# EAGLE design vdac (EAGLE 8.3.1)

## Sheet 1 of 4
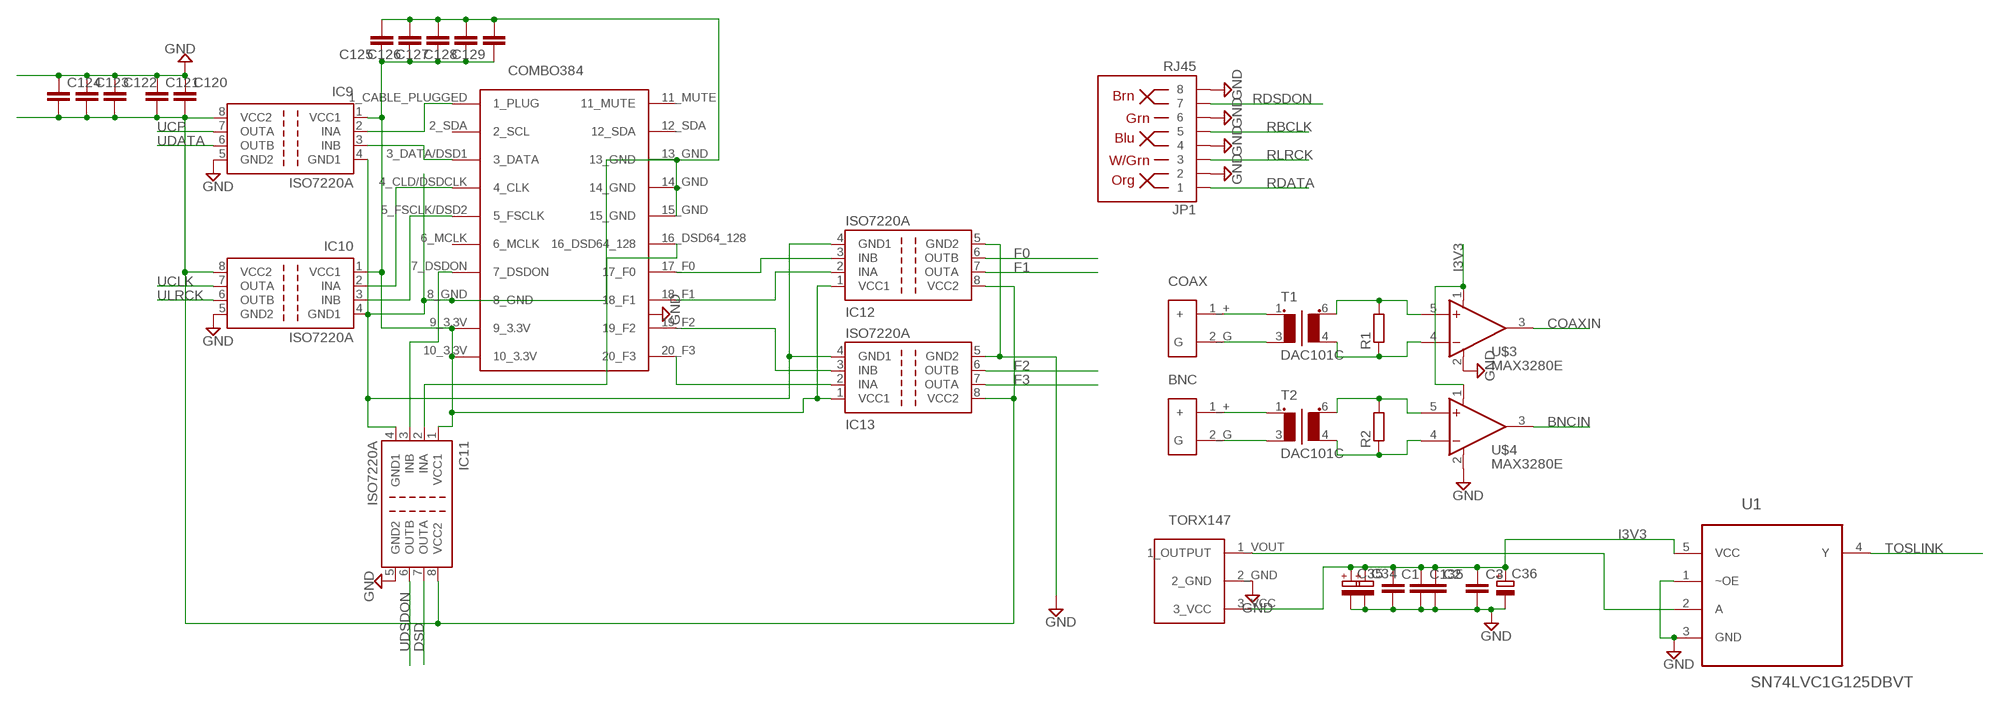
[diagram p0: schematic, sheet 1]

### Parts
BNC  RCA  [RCA]
C1  C-EUC0805  [C0805]
C2  C-EUC0805  [C0805]
C3  C-EUC0805  [C0805]
C34  CPOL-EUSP-CAP-CX  [SP-CAP-CX]
C35  CPOL-EUSP-CAP-CX  [SP-CAP-CX]
C36  CPOL-EUSP-CAP-CX  [SP-CAP-CX]
C120  C-EUC0805  [C0805]
C121  C-EUC0805  [C0805]
C122  C-EUC0805  [C0805]
C123  C-EUC0805  [C0805]
C124  C-EUC0805  [C0805]
C125  C-EUC0805  [C0805]
C126  C-EUC0805  [C0805]
C127  C-EUC0805  [C0805]
C128  C-EUC0805  [C0805]
C129  C-EUC0805  [C0805]
C135  C-EUC0805  [C0805]
COAX  RCA  [RCA]
IC9  ISO7220A  [SO-08]
IC10  ISO7220A  [SO-08]
IC11  ISO7220A  [SO-08]
IC12  ISO7220A  [SO-08]
IC13  ISO7220A  [SO-08]
JP1  RJ45  RJ45-8PTH  [RJ45-8]
R1  R-EU_MELF0204W  [MINI_MELF-0204W]
R2  R-EU_MELF0204W  [MINI_MELF-0204W]
T1  DAC101C  [DAC101]
T2  DAC101C  [DAC101]
U1  SN74LVC1G125DBVT  [SOT95P280X145-5N]
U$1  COMBO384  [COMBO384]
U$2  TORX147  [TORX147]
U$3  MAX3280E  [SOT23-5L]
U$4  MAX3280E  [SOT23-5L]

### Nets
BNCIN: U$4.3(OUT) ; also sheet 3
COAXIN: U$3.3(OUT) ; also sheet 3
DSD: IC11.7(OUTA) ; also sheet 3
F0: IC12.6(OUTB) ; also sheet 3
F1: IC12.7(OUTA) ; also sheet 3
F2: IC13.6(OUTB) ; also sheet 3
F3: IC13.7(OUTA) ; also sheet 3
GND: C1.2 C2.2 C3.2 C34.- C35.- C36.- C120.1 C121.1 C122.1 C123.1 C124.1 C135.2 IC9.5(GND2) IC10.5(GND2) IC11.5(GND2) IC12.5(GND2) IC13.5(GND2) JP1.2 JP1.4 JP1.6 JP1.8 U1.1(~OE) U1.3(GND) U$2.2_GND U$3.2(V-) U$4.2(V-) ; also sheet 2,3,4
I3V3: C1.1 C2.1 C3.1 C34.+ C35.+ C36.+ C120.2 C121.2 C122.2 C123.2 C124.2 C135.1 IC9.8(VCC2) IC10.8(VCC2) IC11.8(VCC2) IC12.8(VCC2) IC13.8(VCC2) U1.5(VCC) U$2.3_VCC U$3.1(V+) U$4.1(V+) ; also sheet 3
N$1: COAX.1_+(+) T1.1
N$2: COAX.2_G(G) T1.3(P2)
N$3: BNC.1_+(+) T2.1
N$4: BNC.2_G(G) T2.3(P2)
N$5: R1.2 T1.6(S1) U$3.5(+IN)
N$6: R1.1 T1.4(S2) U$3.4(-IN)
N$7: R2.2 T2.6(S1) U$4.5(+IN)
N$8: R2.1 T2.4(S2) U$4.4(-IN)
N$86: U1.2(A) U$2.1_VOUT(1_OUTPUT)
N$90: IC9.2(INA) U$1.1_CABLE_PLUGGED(1_PLUG)
N$93: IC9.3(INB) U$1.3_DATA/DSD1(3_DATA)
N$94: IC10.2(INA) U$1.4_CLD/DSDCLK(4_CLK)
N$95: IC10.3(INB) U$1.5_FSCLK/DSD2(5_FSCLK)
N$97: IC11.3(INB) U$1.7_DSDON
N$98: C125.1 C126.1 C127.1 C128.1 C129.1 IC9.1(VCC1) IC10.1(VCC1) IC11.1(VCC1) IC12.1(VCC1) IC13.1(VCC1) U$1.9_3.3V U$1.10_3.3V
N$99: IC11.2(INA) U$1.16_DSD64_128
N$100: IC12.3(INB) U$1.17_F0
N$101: IC12.2(INA) U$1.18_F1
N$102: IC13.3(INB) U$1.19_F2
N$103: IC13.2(INA) U$1.20_F3
RBCLK: JP1.5 ; also sheet 3
RDATA: JP1.1 ; also sheet 3
RDSDON: JP1.7 ; also sheet 3
RLRCK: JP1.3 ; also sheet 3
TOSLINK: U1.4(Y) ; also sheet 3
UCLK: IC10.7(OUTA) ; also sheet 3
UCP: IC9.7(OUTA)
UDATA: IC9.6(OUTB) ; also sheet 3
UDSDON: IC11.6(OUTB) ; also sheet 3
UGND: C125.2 C126.2 C127.2 C128.2 C129.2 IC9.4(GND1) IC10.4(GND1) IC11.4(GND1) IC12.4(GND1) IC13.4(GND1) U$1.8_GND U$1.13_GND U$1.14_GND U$1.15_GND
ULRCK: IC10.6(OUTB) ; also sheet 3
Unconnected: U$1.2_SDA(2_SCL) U$1.6_MCLK U$1.11_MUTE U$1.12_SDA

## Sheet 2 of 4
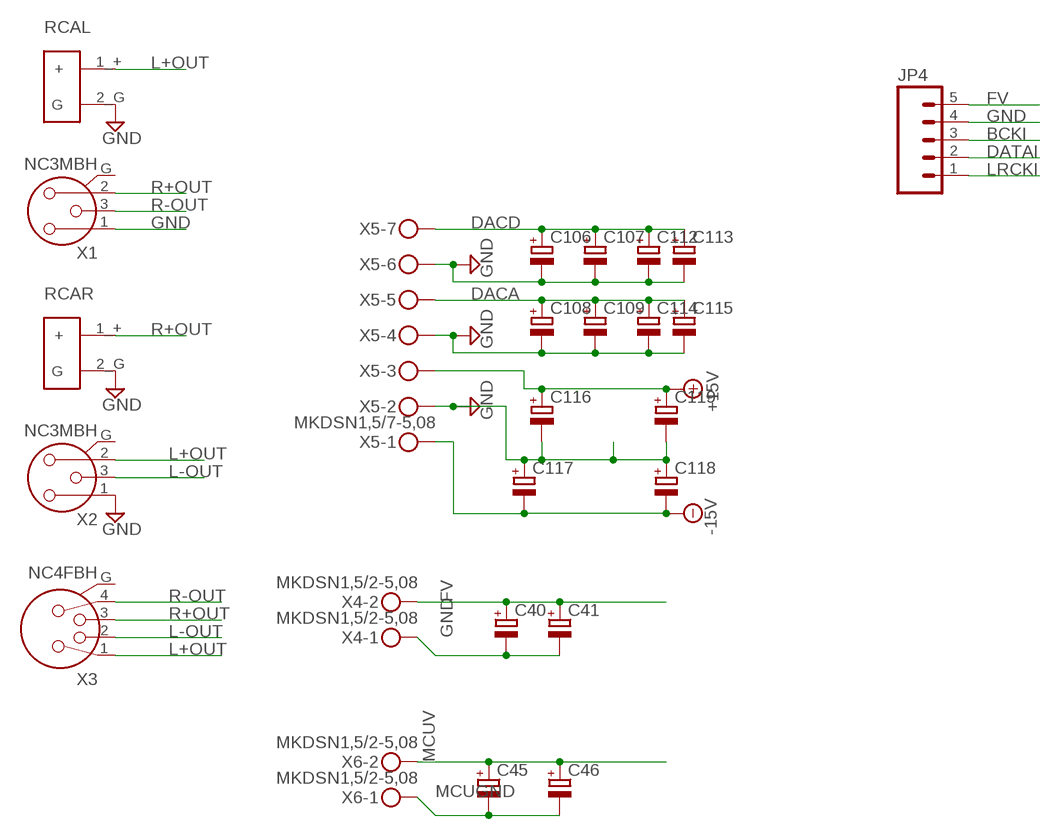
[diagram p1: schematic, sheet 2]

### Parts
C40  CPOL-EUSP-CAP-CX  [SP-CAP-CX]
C41  CPOL-EUSP-CAP-CX  [SP-CAP-CX]
C45  CPOL-EUSP-CAP-CX  [SP-CAP-CX]
C46  CPOL-EUSP-CAP-CX  [SP-CAP-CX]
C106  CPOL-EUSP-CAP-CX  [SP-CAP-CX]
C107  CPOL-EUSP-CAP-CX  [SP-CAP-CX]
C108  CPOL-EUSP-CAP-CX  [SP-CAP-CX]
C109  CPOL-EUSP-CAP-CX  [SP-CAP-CX]
C112  CPOL-EUSP-CAP-CX  [SP-CAP-CX]
C113  CPOL-EUSP-CAP-CX  [SP-CAP-CX]
C114  CPOL-EUSP-CAP-CX  [SP-CAP-CX]
C115  CPOL-EUSP-CAP-CX  [SP-CAP-CX]
C116  CPOL-EUSP-CAP-CX  [SP-CAP-CX]
C117  CPOL-EUSP-CAP-CX  [SP-CAP-CX]
C118  CPOL-EUSP-CAP-CX  [SP-CAP-CX]
C119  CPOL-EUSP-CAP-CX  [SP-CAP-CX]
JP4  M05PTH_LONGPADS  [1X05_LONGPADS]
RCAL  RCA  [RCA]
RCAR  RCA  [RCA]
X1  NC3MBH  [NC3MBH]
X2  NC3MBH  [NC3MBH]
X3  NC4FBH  [NC4FBH]
X4  MKDSN1,5/2-5,08  [MKDSN1,5/2-5,08]
X5  MKDSN1,5/7-5,08  [MKDSN1,5/7-5,08]
X6  MKDSN1,5/2-5,08  [MKDSN1,5/2-5,08]

### Nets
+15V: C116.+ C119.+ X5.3 ; also sheet 4
-15V: C117.- C118.- X5.1 ; also sheet 4
BCKI: JP4.3 ; also sheet 3
DACA: C108.+ C109.+ C114.+ C115.+ X5.5
DACD: C106.+ C107.+ C112.+ C113.+ X5.7
DATAI: JP4.2 ; also sheet 3
FV: C40.+ C41.+ JP4.5 X4.2 ; also sheet 3
GND: C40.- C41.- C106.- C107.- C108.- C109.- C112.- C113.- C114.- C115.- C116.- C117.+ C118.+ C119.- JP4.4 RCAL.2_G(G) RCAR.2_G(G) X1.1 X2.1 X4.1 X5.2 X5.4 X5.6 ; also sheet 1,3,4
L+OUT: RCAL.1_+(+) X2.2 X3.1
L-OUT: X2.3 X3.2
LRCKI: JP4.1 ; also sheet 3
MCUGND: C45.- C46.- X6.1 ; also sheet 3
MCUV: C45.+ C46.+ X6.2 ; also sheet 3
R+OUT: RCAR.1_+(+) X1.2 X3.3
R-OUT: X1.3 X3.4
Unconnected: X1.G X2.G X3.G

## Sheet 3 of 4
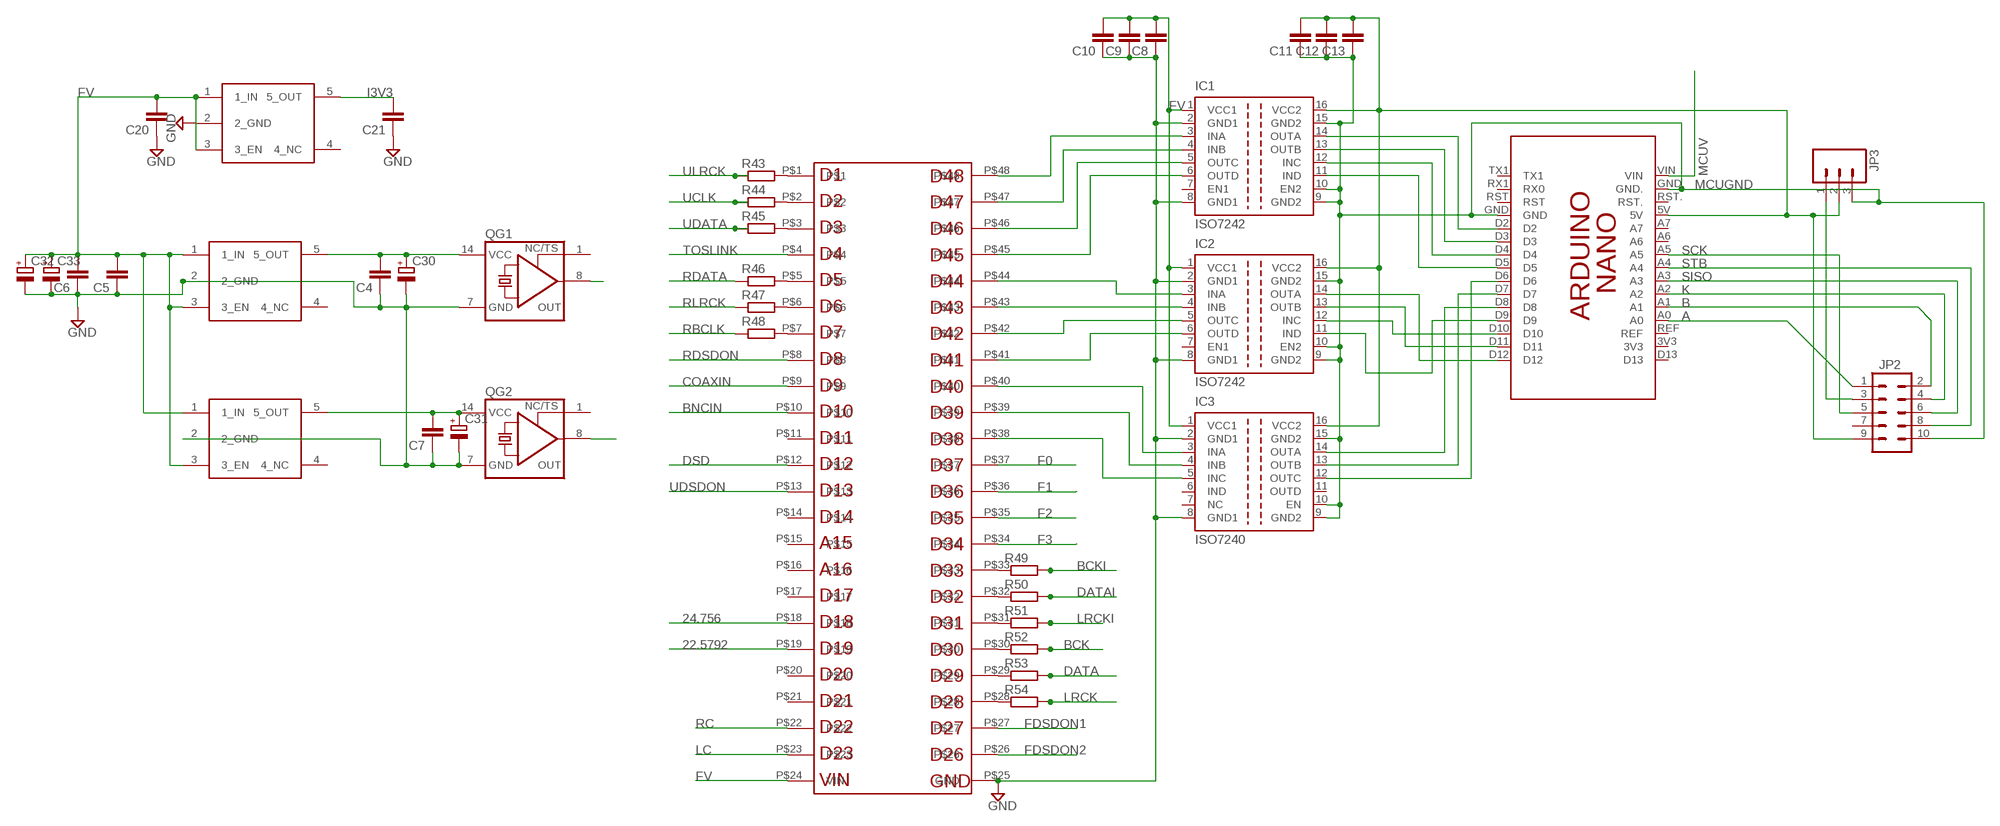
[diagram p2: schematic, sheet 3]

### Parts
C4  C-EUC0805  [C0805]
C5  C-EUC0805  [C0805]
C6  C-EUC0805  [C0805]
C7  C-EUC0805  [C0805]
C8  C-EUC0805  [C0805]
C9  C-EUC0805  [C0805]
C10  C-EUC0805  [C0805]
C11  C-EUC0805  [C0805]
C12  C-EUC0805  [C0805]
C13  C-EUC0805  [C0805]
C20  C-EUC0805  [C0805]
C21  C-EUC0805  [C0805]
C30  CPOL-EUSP-CAP-CX  [SP-CAP-CX]
C31  CPOL-EUSP-CAP-CX  [SP-CAP-CX]
C32  CPOL-EUSP-CAP-CX  [SP-CAP-CX]
C33  CPOL-EUSP-CAP-CX  [SP-CAP-CX]
IC1  ISO7242  [SO-16DW]
IC2  ISO7242  [SO-16DW]
IC3  ISO7240  [SO-16DW]
JP2  M05X2SHD  [2X5-SHROUDED]
JP3  M03JST-PTH-VERT  [JST-3-PTH-VERT]
PCB1  ARDUINO_NANO  [ARDUINO_NANO]
QG1  XO-14  [DIL14S]
QG2  XO-14  [DIL14S]
R43  R-EU_MELF0204W  [MINI_MELF-0204W]
R44  R-EU_MELF0204W  [MINI_MELF-0204W]
R45  R-EU_MELF0204W  [MINI_MELF-0204W]
R46  R-EU_MELF0204W  [MINI_MELF-0204W]
R47  R-EU_MELF0204W  [MINI_MELF-0204W]
R48  R-EU_MELF0204W  [MINI_MELF-0204W]
R49  R-EU_MELF0204W  [MINI_MELF-0204W]
R50  R-EU_MELF0204W  [MINI_MELF-0204W]
R51  R-EU_MELF0204W  [MINI_MELF-0204W]
R52  R-EU_MELF0204W  [MINI_MELF-0204W]
R53  R-EU_MELF0204W  [MINI_MELF-0204W]
R54  R-EU_MELF0204W  [MINI_MELF-0204W]
U$10  LP5907  [SOT-23-5]
U$12  CMOD-A7  [CMODA7]
U$15  LP5907  [SOT-23-5]
U$16  LP5907  [SOT-23-5]

### Nets
22.5792: QG2.8(OUT) U$12.P$19
24.756: QG1.8(OUT) U$12.P$18
A: JP2.1 PCB1.A0
B: JP2.2 PCB1.A1
BCK: R52.2
BCKI: R49.2 ; also sheet 2
BNCIN: U$12.P$10 ; also sheet 1
COAXIN: U$12.P$9 ; also sheet 1
D2: IC1.14(OUTA) PCB1.D2
D3: IC1.13(OUTB) PCB1.D3
D4: IC1.12(INC) PCB1.D4
D5: IC1.11(IND) PCB1.D5
DATA: R53.2
DATAI: R50.2 ; also sheet 2
DSD: U$12.P$12 ; also sheet 1
F0: U$12.P$37 ; also sheet 1
F1: U$12.P$36 ; also sheet 1
F2: U$12.P$35 ; also sheet 1
F3: U$12.P$34 ; also sheet 1
FDSDON1: U$12.P$27
FDSDON2: U$12.P$26
FV: C5.2 C6.2 C8.2 C9.2 C10.2 C20.2 C32.+ C33.+ IC1.1(VCC1) IC2.1(VCC1) IC3.1(VCC1) U$10.1(1_IN) U$10.3(3_EN) U$12.P$24(VIN) U$15.1(1_IN) U$15.3(3_EN) U$16.1(1_IN) U$16.3(3_EN) ; also sheet 2
GND: C4.1 C5.1 C6.1 C7.1 C8.1 C9.1 C10.1 C20.1 C21.1 C30.- C31.- C32.- C33.- IC1.2(GND1) IC1.8(GND1) IC2.2(GND1) IC2.8(GND1) IC3.2(GND1) IC3.8(GND1) QG1.7(GND) QG2.7(GND) U$10.2(2_GND) U$12.P$25(GND) U$15.2(2_GND) U$16.2(2_GND) ; also sheet 1,2,4
I3V3: C21.2 U$10.5(5_OUT) ; also sheet 1
K: JP2.4 PCB1.A2
LC: U$12.P$23
LRCK: R54.2
LRCKI: R51.2 ; also sheet 2
MCUGND: C11.1 C12.1 C13.1 IC1.9(GND2) IC1.10(EN2) IC1.15(GND2) IC2.9(GND2) IC2.10(EN2) IC2.15(GND2) IC3.9(GND2) IC3.10(EN) IC3.15(GND2) JP2.10 JP3.3 PCB1.GND PCB1.GND. ; also sheet 2
MCUV: PCB1.VIN ; also sheet 2
N$20: R43.2 U$12.P$1
N$25: C4.2 C30.+ QG1.14(VCC) U$15.5(5_OUT)
N$27: C7.2 C31.+ QG2.14(VCC) U$16.5(5_OUT)
N$32: IC1.3(INA) U$12.P$48
N$33: IC1.4(INB) U$12.P$47
N$35: IC1.5(OUTC) U$12.P$46
N$36: IC1.6(OUTD) U$12.P$45
N$39: IC2.3(INA) U$12.P$44
N$40: IC2.4(INB) U$12.P$43
N$42: IC2.5(OUTC) U$12.P$42
N$43: IC2.6(OUTD) U$12.P$41
N$44: IC3.3(INA) U$12.P$40
N$45: IC3.4(INB) U$12.P$39
N$46: IC3.5(INC) U$12.P$38
N$51: IC2.14(OUTA) PCB1.D12
N$52: IC2.13(OUTB) PCB1.D11
N$53: IC2.12(INC) PCB1.D10
N$54: IC2.11(IND) PCB1.D9
N$55: IC3.14(OUTA) PCB1.D8
N$56: IC3.13(OUTB) PCB1.D7
N$57: IC3.12(OUTC) PCB1.D6
N$91: C11.2 C12.2 C13.2 IC1.16(VCC2) IC2.16(VCC2) IC3.16(VCC2) JP2.9 JP3.2 PCB1.5V
N$92: JP2.3 JP3.1
N$129: R44.2 U$12.P$2
N$132: R45.2 U$12.P$3
N$133: R46.2 U$12.P$5
N$134: R47.2 U$12.P$6
N$135: R48.2 U$12.P$7
N$136: R49.1 U$12.P$33
N$137: R50.1 U$12.P$32
N$138: R51.1 U$12.P$31
N$139: R52.1 U$12.P$30
N$140: R53.1 U$12.P$29
N$141: R54.1 U$12.P$28
RBCLK: R48.1 ; also sheet 1
RC: U$12.P$22
RDATA: R46.1 ; also sheet 1
RDSDON: U$12.P$8 ; also sheet 1
RLRCK: R47.1 ; also sheet 1
SCK: JP2.5 PCB1.A5
SISO: JP2.6 PCB1.A3
STB: JP2.8 PCB1.A4
TOSLINK: U$12.P$4 ; also sheet 1
UCLK: R44.1 ; also sheet 1
UDATA: R45.1 ; also sheet 1
UDSDON: U$12.P$13 ; also sheet 1
ULRCK: R43.1 ; also sheet 1
Unconnected: IC1.7(EN1) IC2.7(EN1) IC3.6(IND) IC3.7(NC) IC3.11(OUTD) JP2.7 PCB1.3V3 PCB1.A6 PCB1.A7 PCB1.D13 PCB1.REF PCB1.RST PCB1.RST. PCB1.RX1(RX0) PCB1.TX1 QG1.1(TS) QG2.1(TS) U$10.4(4_NC) U$12.P$11 U$12.P$14 U$12.P$15 U$12.P$16 U$12.P$17 U$12.P$20 U$12.P$21 U$15.4(4_NC) U$16.4(4_NC)

## Sheet 4 of 4
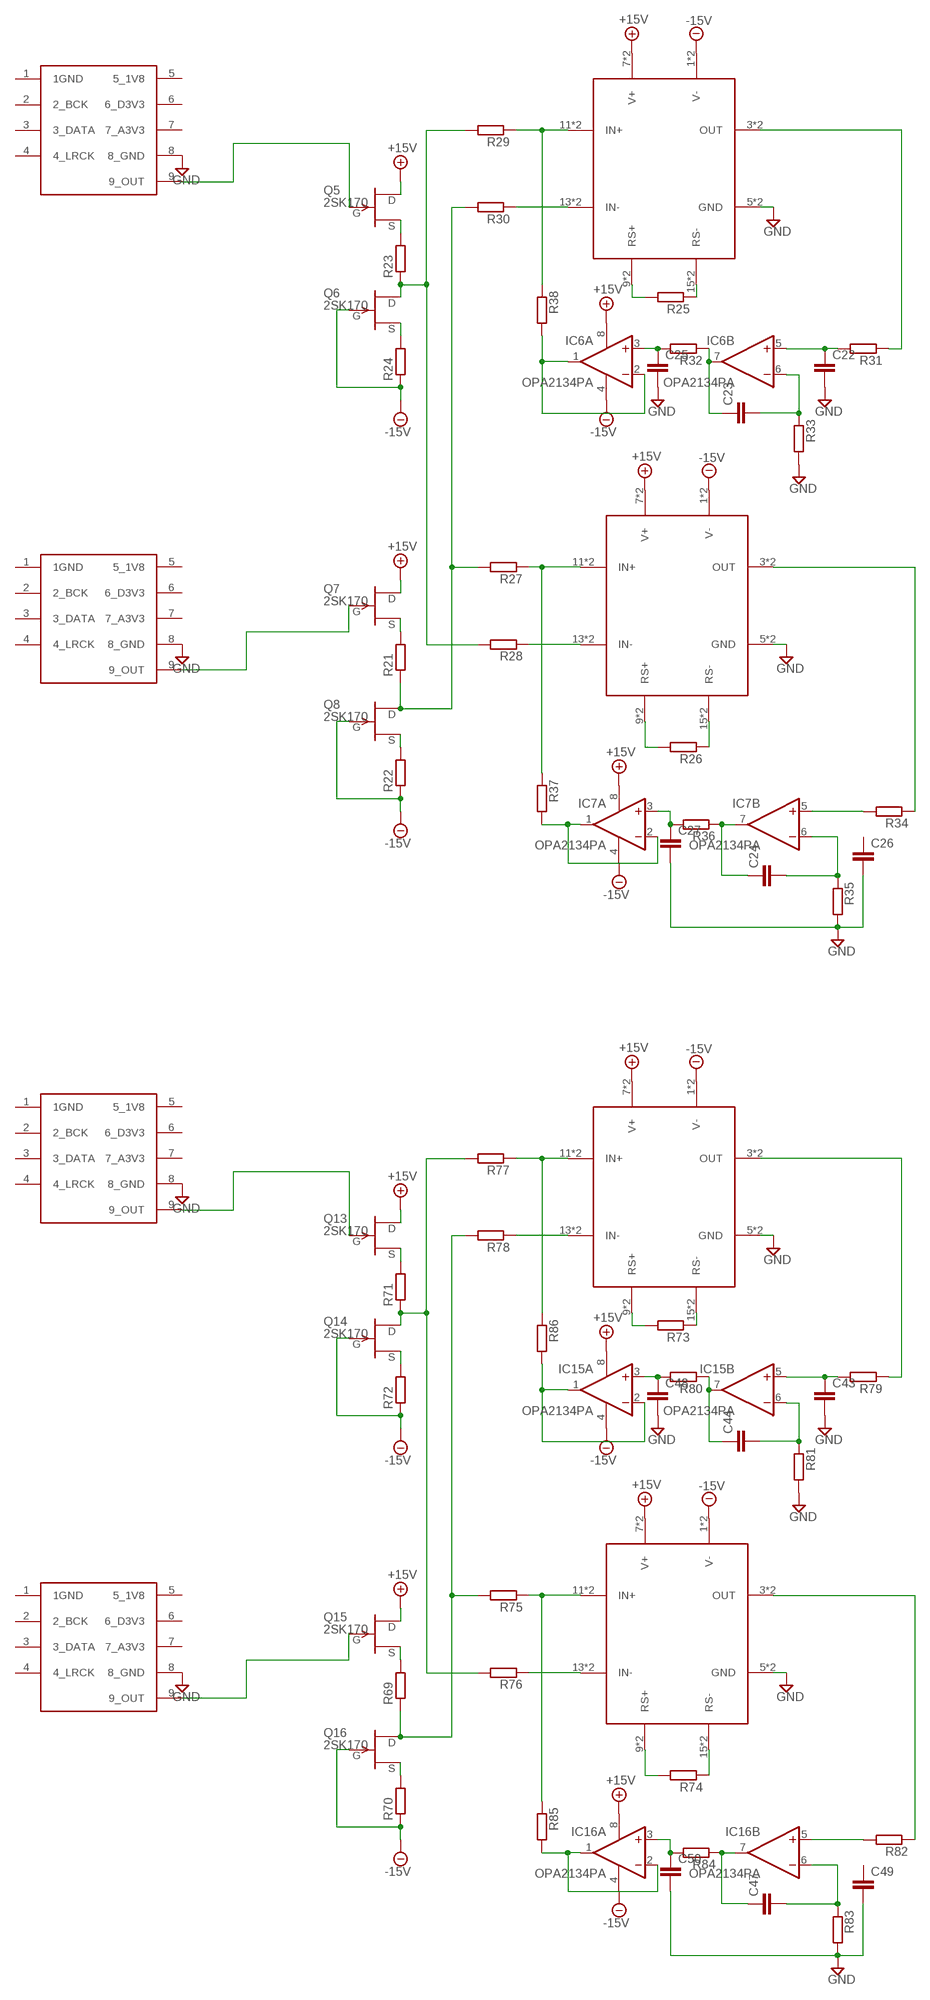
[diagram p3: schematic, sheet 4]

### Parts
C22  C-EU050-050X075  [C050-050X075]
C23  C-EU050-035X075  [C050-035X075]
C24  C-EU050-035X075  [C050-035X075]
C25  C-EU050-035X075  [C050-035X075]
C26  C-EU050-050X075  [C050-050X075]
C27  C-EU050-035X075  [C050-035X075]
C43  C-EU050-050X075  [C050-050X075]
C44  C-EU050-035X075  [C050-035X075]
C47  C-EU050-035X075  [C050-035X075]
C48  C-EU050-035X075  [C050-035X075]
C49  C-EU050-050X075  [C050-050X075]
C50  C-EU050-035X075  [C050-035X075]
IC6  OPA2134PA  [DIL08]
IC7  OPA2134PA  [DIL08]
IC15  OPA2134PA  [DIL08]
IC16  OPA2134PA  [DIL08]
Q5  2SK170  [TO92-]
Q6  2SK170  [TO92-]
Q7  2SK170  [TO92-]
Q8  2SK170  [TO92-]
Q13  2SK170  [TO92-]
Q14  2SK170  [TO92-]
Q15  2SK170  [TO92-]
Q16  2SK170  [TO92-]
R21  R-EU_0309/10  [0309/10]
R22  R-EU_0309/10  [0309/10]
R23  R-EU_0309/10  [0309/10]
R24  R-EU_0309/10  [0309/10]
R25  R-EU_0309/10  [0309/10]
R26  R-EU_0309/10  [0309/10]
R27  R-EU_0309/10  [0309/10]
R28  R-EU_0309/10  [0309/10]
R29  R-EU_0309/10  [0309/10]
R30  R-EU_0309/10  [0309/10]
R31  R-EU_0309/10  [0309/10]
R32  R-EU_0309/10  [0309/10]
R33  R-EU_0309/10  [0309/10]
R34  R-EU_0309/10  [0309/10]
R35  R-EU_0309/10  [0309/10]
R36  R-EU_0309/10  [0309/10]
R37  R-EU_0309/10  [0309/10]
R38  R-EU_0309/10  [0309/10]
R69  R-EU_0309/10  [0309/10]
R70  R-EU_0309/10  [0309/10]
R71  R-EU_0309/10  [0309/10]
R72  R-EU_0309/10  [0309/10]
R73  R-EU_0309/10  [0309/10]
R74  R-EU_0309/10  [0309/10]
R75  R-EU_0309/10  [0309/10]
R76  R-EU_0309/10  [0309/10]
R77  R-EU_0309/10  [0309/10]
R78  R-EU_0309/10  [0309/10]
R79  R-EU_0309/10  [0309/10]
R80  R-EU_0309/10  [0309/10]
R81  R-EU_0309/10  [0309/10]
R82  R-EU_0309/10  [0309/10]
R83  R-EU_0309/10  [0309/10]
R84  R-EU_0309/10  [0309/10]
R85  R-EU_0309/10  [0309/10]
R86  R-EU_0309/10  [0309/10]
U$9  R2R  [R2R]
U$11  R2R  [R2R]
U$13  7130MOD  [7130MOD]
U$14  7130MOD  [7130MOD]
U$21  R2R  [R2R]
U$22  R2R  [R2R]
U$23  7130MOD  [7130MOD]
U$24  7130MOD  [7130MOD]

### Nets
+15V: IC6.8(A:V+) IC7.8(A:V+) IC15.8(A:V+) IC16.8(A:V+) Q5.1(D) Q7.1(D) Q13.1(D) Q15.1(D) U$13.7(V+) U$13.8(V+) U$14.7(V+) U$14.8(V+) U$23.7(V+) U$23.8(V+) U$24.7(V+) U$24.8(V+) ; also sheet 2
-15V: IC6.4(A:V-) IC7.4(A:V-) IC15.4(A:V-) IC16.4(A:V-) Q6.2(G) Q8.2(G) Q14.2(G) Q16.2(G) R22.1 R24.1 R70.1 R72.1 U$13.1(V-) U$13.2(V-) U$14.1(V-) U$14.2(V-) U$23.1(V-) U$23.2(V-) U$24.1(V-) U$24.2(V-) ; also sheet 2
GND: C22.2 C25.2 C26.2 C27.2 C43.2 C48.2 C49.2 C50.2 R33.2 R35.2 R81.2 R83.2 U$9.8(8_GND) U$11.8(8_GND) U$13.5(GND) U$13.6(GND) U$14.5(GND) U$14.6(GND) U$21.8(8_GND) U$22.8(8_GND) U$23.5(GND) U$23.6(GND) U$24.5(GND) U$24.6(GND) ; also sheet 1,2,3
N$65: Q8.3(S) R22.2
N$66: Q7.3(S) R21.2
N$67: Q6.3(S) R24.2
N$68: Q6.1(D) R23.1 R28.2 R29.2
N$69: R26.1 U$13.15(RS-) U$13.16(RS-)
N$70: R26.2 U$13.9(RS+) U$13.10(RS+)
N$71: R25.2 U$14.9(RS+) U$14.10(RS+)
N$72: R25.1 U$14.15(RS-) U$14.16(RS-)
N$73: Q5.3(S) R23.2
N$74: Q8.1(D) R21.1 R27.2 R30.2
N$75: Q7.2(G) U$11.9(9_OUT)
N$76: Q5.2(G) U$9.9(9_OUT)
N$77: R27.1 R37.1 U$13.11(IN+) U$13.12(IN+)
N$78: R28.1 U$13.13(IN-) U$13.14(IN-)
N$79: R29.1 R38.1 U$14.11(IN+) U$14.12(IN+)
N$80: R30.1 U$14.13(IN-) U$14.14(IN-)
N$81: C22.1 IC6.5(B:+IN) R31.2
N$82: R31.1 U$14.3(OUT) U$14.4(OUT)
N$83: IC7.1(A:OUT) IC7.2(A:-IN) R37.2
N$84: IC6.1(A:OUT) IC6.2(A:-IN) R38.2
N$85: C24.1 IC7.7(B:OUT) R36.1
N$87: C24.2 IC7.6(B:-IN) R35.1
N$88: C23.1 IC6.7(B:OUT) R32.1
N$104: C25.1 IC6.3(A:+IN) R32.2
N$105: C23.2 IC6.6(B:-IN) R33.1
N$106: C27.1 IC7.3(A:+IN) R36.2
N$107: IC7.5(B:+IN) R34.2
N$108: R34.1 U$13.3(OUT) U$13.4(OUT)
N$148: Q16.3(S) R70.2
N$149: Q15.3(S) R69.2
N$150: Q14.3(S) R72.2
N$151: Q14.1(D) R71.1 R76.2 R77.2
N$152: R74.1 U$23.15(RS-) U$23.16(RS-)
N$153: R74.2 U$23.9(RS+) U$23.10(RS+)
N$154: R73.2 U$24.9(RS+) U$24.10(RS+)
N$155: R73.1 U$24.15(RS-) U$24.16(RS-)
N$156: Q13.3(S) R71.2
N$157: Q16.1(D) R69.1 R75.2 R78.2
N$158: Q15.2(G) U$22.9(9_OUT)
N$159: Q13.2(G) U$21.9(9_OUT)
N$160: R75.1 R85.1 U$23.11(IN+) U$23.12(IN+)
N$161: R76.1 U$23.13(IN-) U$23.14(IN-)
N$162: R77.1 R86.1 U$24.11(IN+) U$24.12(IN+)
N$163: R78.1 U$24.13(IN-) U$24.14(IN-)
N$164: C43.1 IC15.5(B:+IN) R79.2
N$165: R79.1 U$24.3(OUT) U$24.4(OUT)
N$166: IC16.1(A:OUT) IC16.2(A:-IN) R85.2
N$167: IC15.1(A:OUT) IC15.2(A:-IN) R86.2
N$168: C47.1 IC16.7(B:OUT) R84.1
N$169: C47.2 IC16.6(B:-IN) R83.1
N$170: C44.1 IC15.7(B:OUT) R80.1
N$171: C48.1 IC15.3(A:+IN) R80.2
N$172: C44.2 IC15.6(B:-IN) R81.1
N$173: C50.1 IC16.3(A:+IN) R84.2
N$174: IC16.5(B:+IN) R82.2
N$175: R82.1 U$23.3(OUT) U$23.4(OUT)
Unconnected: C26.1 C49.1 U$9.1(1GND) U$9.2(2_BCK) U$9.3(3_DATA) U$9.4(4_LRCK) U$9.5(5_1V8) U$9.6(6_D3V3) U$9.7(7_A3V3) U$11.1(1GND) U$11.2(2_BCK) U$11.3(3_DATA) U$11.4(4_LRCK) U$11.5(5_1V8) U$11.6(6_D3V3) U$11.7(7_A3V3) U$21.1(1GND) U$21.2(2_BCK) U$21.3(3_DATA) U$21.4(4_LRCK) U$21.5(5_1V8) U$21.6(6_D3V3) U$21.7(7_A3V3) U$22.1(1GND) U$22.2(2_BCK) U$22.3(3_DATA) U$22.4(4_LRCK) U$22.5(5_1V8) U$22.6(6_D3V3) U$22.7(7_A3V3)

## Library data of the parts
BNC COAX RCAL RCAR = Vwvwbg:RCA
C1-C13 C20-C27 C43 C44 C47-C50 C120-C129 C135 = Vwvwbg:C-EU: CAPACITOR, European symbol
C30-C36 C40 C41 C45 C46 C106-C109 C112-C119 = Vwvwbg:CPOL-EU: POLARIZED CAPACITOR, European symbol
IC1 IC2 = texas:ISO7242: HIGH SPEED QUAD DIGITAL ISOLATORS Source: http://focus.ti.com/lit/ds/symlink/iso7240m.pdf; MPN: ISO7242MDW; OC_FARNELL: 1755127; OC_NEWARK: 73M3163
IC3 = texas:ISO7240: HIGH SPEED QUAD DIGITAL ISOLATORS Source: http://focus.ti.com/lit/ds/symlink/iso7240m.pdf; MPN: ISO7240MDW; OC_FARNELL: 1755124; OC_NEWARK: 58M0385
IC6 IC7 IC15 IC16 = linear:OPA2*: Dual Operational Amplifier Low Power, Single-Supply, Rail-To-Rail Operational Amplifier Source: http://focus.ti.com/lit/ds/symlink/opa2345.pdf http://focus.ti.com .. opa241.pdf http://focus.ti.com/lit/ds/symlink/opa2134.pdf
IC9-IC13 = texas:ISO7220: DUAL DIGITAL ISOLATORS Source: http://focus.ti.com/lit/ds/symlink/iso7221a.pdf; MPN: ISO7220AD; OC_FARNELL: 1390649; OC_NEWARK: 48M0666
JP1 = SparkFun-Connectors:RJ45-8: RJ45 Jack Simple RJ45, 8-pin connection - connector for common Cat5, Cat5e, and Cat6 Ethernet cables. Footprint not yet proven in production. Connector sku is PRT-00643; Breakout PCB sku is BOB-00716.; PROD_ID: CONN-08506
JP2 = SparkFun-Connectors:M05X2: Header 5x2 Standard 10-pin dual row 0.1" header. Commonly used with AVR-ISP. Use with Spark Fun Electronics SKU: PRT-00778
JP3 = SparkFun-Connectors:M03: Header 3 Standard 3-pin 0.1" header. Use with straight break away headers (SKU : PRT-00116), right angle break away headers (PRT-00553), swiss pins (PRT-00743), machine pins (PRT-00117), and female headers (PRT-00115). Molex polarized connector foot print use with SKU : PRT-08232 with associated crimp pins and housings.
JP4 = SparkFun-Connectors:M05: Header 5 Standard 5-pin 0.1" header. Use with straight break away headers (SKU : PRT-00116), right angle break away headers (PRT-00553), swiss pins (PRT-00743), machine pins (PRT-00117), and female headers (PRT-00115). Molex polarized connector foot print use with SKU : PRT-08230 with associated crimp pins and housings.
PCB1 = E14_Arduino_revB:ARDUINO_NANO: Device for representing an Arduino Nano board with a footprint in an EAGLE design. Created by Dave Young for Element14. More EAGLE documentation at: http://www.element14.com/community/community/knode/cadsoft_eagle
Q5-Q8 Q13-Q16 = tranzistory FET:2SK170: N-Channel Junction FET
QG1 QG2 = crystal:XO-: CRYSTAL; OC_FARNELL: unknown; OC_NEWARK: unknown
R1 R2 R21-R38 R43-R54 R69-R86 = Vwvwbg:R-EU_: RESISTOR, European symbol
T1 T2 = transformer-pulse:DAC101C
U1 = Texas Instruments_By_element14_Batch_1:SN74LVC1G125DBVT: Single Bus buffer gate with 3 state output; MPN: SN74LVC1G125DBVT; OC_FARNELL: 1607643; OC_NEWARK: 32H6348; PACKAGE: SOT-23-5; SUPPLIER: Texas Instruments
U$1 = Vwvwbg:COMBO384
U$2 = Vwvwbg:TORX147
U$3 U$4 = maxim:MAX3280E
U$9 U$11 U$21 U$22 = Vwvwbg:R2R
U$10 U$15 U$16 = Vwvwbg:LP5907
U$12 = Vwvwbg:CMOD-A7
U$13 U$14 U$23 U$24 = Vwvwbg:7130MOD
X1 X2 = con-neutrik_ag:NC3: Neutrik Audio Connector XLR SERIES Stereo 1/4" jack Source: www.neutrik.com/; MF: NEUTRIK; MPN: NC3MBH; OC_FARNELL: unknown; OC_NEWARK: 91F3470
X3 = con-neutrik_ag:NC4: Neutrik Audio Connector XLR SERIES Stereo 1/4" jack Source: www.neutrik.com/; OC_FARNELL: unknown; OC_NEWARK: unknown
X4 X6 = con-phoenix-508:MKDSN1,5/2-5,08: MKDSN 1,5/ 2-5,08 Printklemme Nennstrom: 13,5 A Nennspannung: 250 V Rastermaß: 5,08 mm Polzahl: 2 Anschlussart: Schraubanschluss Montage: Löten Anschlussrichtung Leiter/Platine: 0 ° Artikelnummer: 1729128 Source: http://eshop.phoenixcontact.com .. 1729128.pdf
X5 = con-phoenix-508:MKDSN1,5/7-5,08: MKDSN 1,5/ 7-5,08 Printklemme Nennstrom: 13,5 A Nennspannung: 250 V Rastermaß: 5,08 mm Polzahl: 7 Anschlussart: Schraubanschluss Montage: Löten Anschlussrichtung Leiter/Platine: 0 ° Artikelnummer: 1729173 Source: http://eshop.phoenixcontact.com .. 1729173.pdf

## Module ADM715X
Ports: 
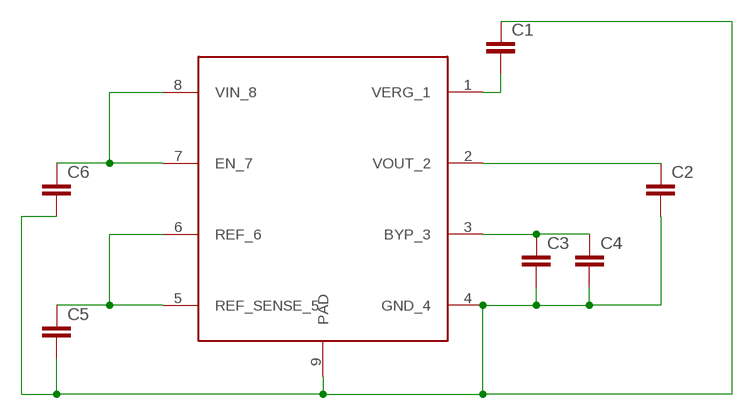
[diagram p4: schematic, module ADM715X, sheet 1]

### Parts
C1  C-EUC1210  [C1210]
C2  C-EUC1210  [C1210]
C3  C-EUC0805  [C0805]
C4  C-EUC0805  [C0805]
C5  C-EUC0805  [C0805]
C6  C-EUC1210  [C1210]
U$1  ADM7150  [SOIC127P600X170-9N]

### Nets
N$1: C6.1 U$1.7(EN_7) U$1.8(VIN_8)
N$2: C5.1 U$1.5(REF_SENSE_5) U$1.6(REF_6)
N$3: C1.1 C2.2 C3.2 C4.2 C5.2 C6.2 U$1.4(GND_4) U$1.9(PAD)
N$4: C3.1 C4.1 U$1.3(BYP_3)
N$5: C2.1 U$1.2(VOUT_2)
N$7: C1.2 U$1.1(VERG_1)

### Library data of the parts
C1-C6 = Vwvwbg:C-EU: CAPACITOR, European symbol
U$1 = Texas Instruments_By_element14_Batch_1:ADM7150

## Board
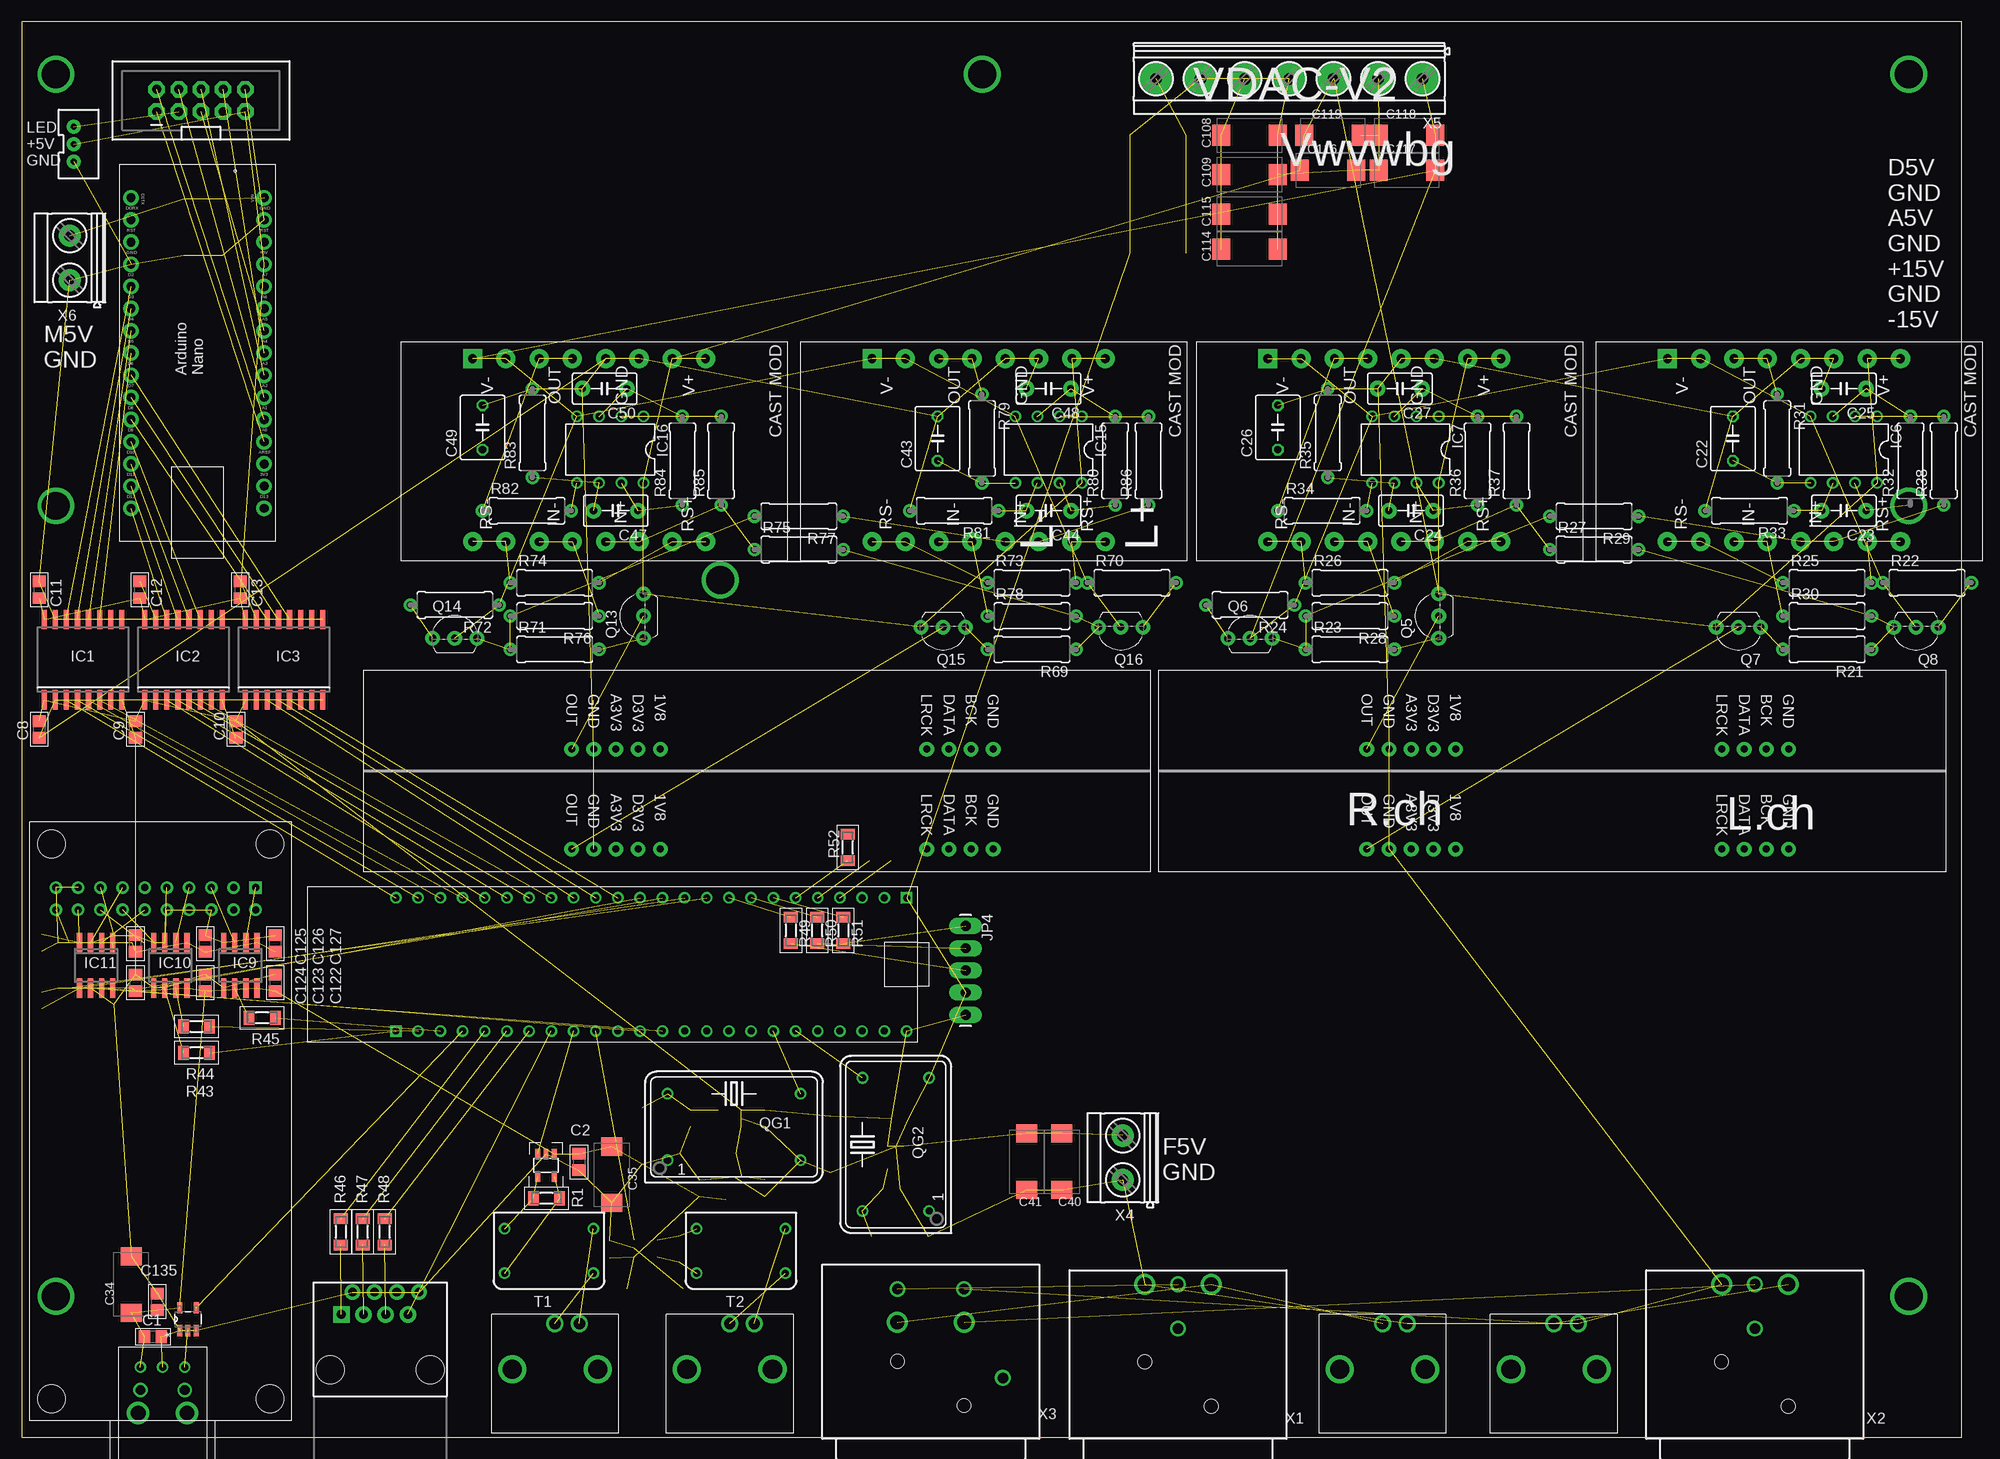
[diagram p5: board, top side]
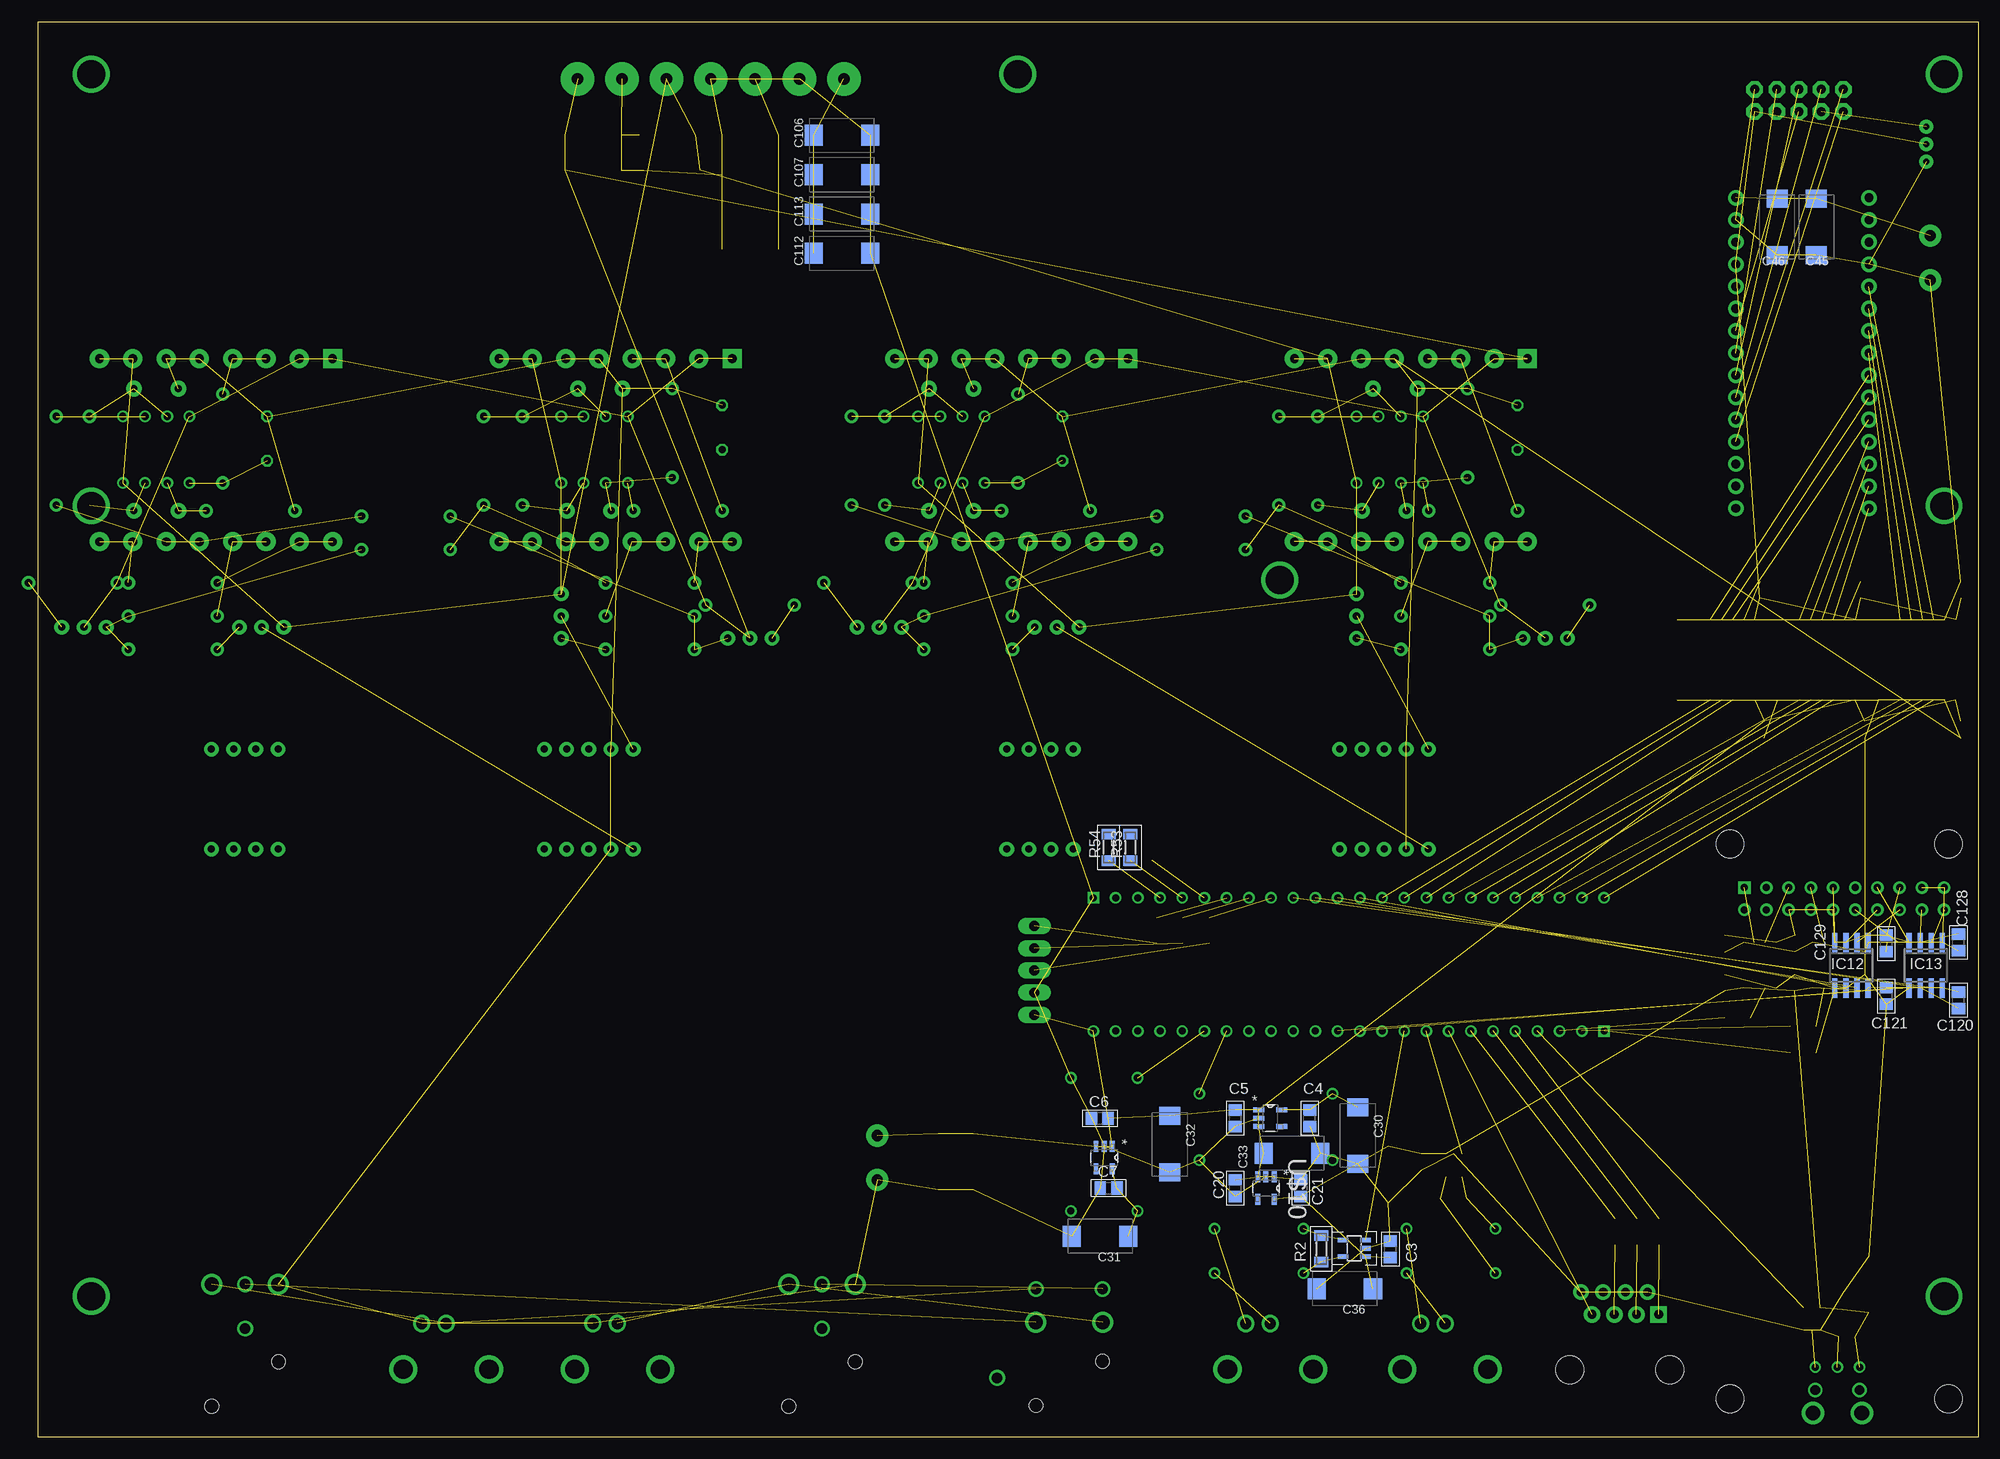
[diagram p6: board, bottom side, seen from below]

Size 222 x 162 mm. Coordinates in mm from the lower left corner, seen from the top.
Outline: 222,162 0,162 0,0 222,0 222,162
Copper layers (1*16): Top 0.035mm / dielectric 1.5mm / Bottom 0.035mm
Design rules "default *": minimum track width 10mil, minimum drill 24mil, track to track 8mil, track to pad 8mil, pad to pad 8mil, via to via 8mil, smd to smd 8mil, copper to edge 8mil, drill to drill 8mil, minimum pad ring 10mil, minimum via ring 8mil, stop-mask expansion 4mil, vias tented up to drill 0mil, thermal gap 10mil

### Footprints (pad centres in the part's own frame; a part is rotated, then mirrored left to right if it is on the bottom)
RCA = drill 1.3: 1_+ 0,0; 2_G -2.8,0 | drill 2.2: 3_NC -4.9,5.25; 4_NC 4.9,5.25
C0805 = smd 1.3 x 1.5: 1 -0.95,0; 2 0.95,0
C050-050X075 = drill 0.813 octagon: 1 -2.54,0; 2 2.54,0
C050-035X075 = drill 0.813 pad 1.778: 1 -2.54,0; 2 2.54,0
SP-CAP-CX = smd 2.062 x 2.4: + -2.754,0; - 3.707,0
SO-16DW = smd 0.6 x 2.2: 1 -4.445,-4.6; 2 -3.175,-4.6; 3 -1.905,-4.6; 4 -0.635,-4.6; 5 0.635,-4.6; 6 1.905,-4.6; 7 3.175,-4.6; 8 4.445,-4.6; 9 4.445,4.6; 10 3.175,4.6; 11 1.905,4.6; 12 0.635,4.6; 13 -0.635,4.6; 14 -1.905,4.6; 15 -3.175,4.6; 16 -4.445,4.6
DIL08 = drill 0.813 pad 1.27: 1 -3.81,-3.81; 2 -1.27,-3.81; 3 1.27,-3.81; 4 3.81,-3.81; 5 3.81,3.81; 6 1.27,3.81; 7 -1.27,3.81; 8 -3.81,3.81
SO-08 = smd 0.6 x 2.2: 1 -1.905,-2.6; 2 -0.635,-2.6; 3 0.635,-2.6; 4 1.905,-2.6; 5 1.905,2.6; 6 0.635,2.6; 7 -0.635,2.6; 8 -1.905,2.6
RJ45-8 = drill 1 pad 1.88 square: 1 -4.445,6.35 | drill 1 pad 1.778: 2 -3.175,8.89; 4 -0.635,8.89; 6 1.905,8.89; 8 4.445,8.89 | drill 1 pad 1.88: 3 -1.905,6.35; 5 0.635,6.35; 7 3.175,6.35 | hole 3.2: -5.715,0; 5.715,0
2X5-SHROUDED = drill 1.016 pad 1.88 octagon: 1 -1.27,5.08; 2 1.27,5.08; 3 -1.27,2.54; 4 1.27,2.54; 5 -1.27,0; 6 1.27,0; 7 -1.27,-2.54; 8 1.27,-2.54; 9 -1.27,-5.08; 10 1.27,-5.08
JST-3-PTH-VERT = drill 0.7 pad 1.6: 1 -2,-0.55; 2 0,-0.55; 3 2,-0.55
1X05_LONGPADS = drill 1.118 pad 1.88 long: 1 0,0; 2 2.54,0; 3 5.08,0; 4 7.62,0; 5 10.16,0
ARDUINO_NANO = drill 1.016 pad 1.778: 3V3 6.35,1.27; 5V 31.75,1.27; A0 11.43,1.27; A1 13.97,1.27; A2 16.51,1.27; A3 19.05,1.27; A4 21.59,1.27; A5 24.13,1.27; A6 26.67,1.27; A7 29.21,1.27; D2 29.21,16.51; D3 26.67,16.51; D4 24.13,16.51; D5 21.59,16.51; D6 19.05,16.51; D7 16.51,16.51; D8 13.97,16.51; D9 11.43,16.51; D10 8.89,16.51; D11 6.35,16.51; D12 3.81,16.51; D13 3.81,1.27; GND 31.75,16.51; GND. 36.83,1.27; REF 8.89,1.27; RST 34.29,16.51; RST. 34.29,1.27; RX1 36.83,16.51; TX1 39.37,16.51; VIN 39.37,1.27
TO92- = drill 0.813 pad 1.676: 1 2.54,0; 2 0,0; 3 -2.54,0
DIL14S = drill 0.813: 1 -7.62,-3.81; 7 7.62,-3.81; 8 7.62,3.81; 14 -7.62,3.81
MINI_MELF-0204W = smd 1.2 x 1.6: 1 -1.5,0; 2 1.5,0
0309/10 = drill 0.813 pad 1.524: 1 -5.08,0; 2 5.08,0
DAC101 = drill 0.8 pad 1.27: 1 -5.08,2.54; 3 -5.08,-2.54; 4 5.08,-2.54; 6 5.08,2.54
SOT95P280X145-5N = smd 1.27 x 0.559: 1 -1.295,0.94; 2 -1.295,0; 3 -1.295,-0.94; 4 1.295,-0.94; 5 1.295,0.94
COMBO384 = drill 0.8 pad 1.422 square: 1_CABLE_PLUGGED 23.36,61 | drill 0.8 pad 1.422: 2_SDA 20.82,61; 3_DATA/DSD1 18.28,61; 4_CLD/DSDCLK 15.74,61; 5_FSCLK/DSD2 13.2,61; 6_MCLK 10.66,61; 7_DSDON 8.12,61; 8_GND 5.58,61; 9_3.3V 3.04,61; 10_3.3V 0.5,61; 11_MUTE 23.36,58.46; 12_SDA 20.82,58.46; 13_GND 18.28,58.46; 14_GND 15.74,58.46; 15_GND 13.2,58.46; 16_DSD64_128 10.66,58.46; 17_F0 8.12,58.46; 18_F1 5.58,58.46; 19_F2 3.04,58.46; 20_F3 0.5,58.46 | hole 3.2: 25,2.5; 0,2.5; 25,66; 0,66
TORX147 = drill 0.8: 1_VOUT -2.54,0; 2_GND 0,0; 3_VCC 2.54,0 | drill 1.1: 4_NC -2.54,2.625; 5_NC 2.54,2.625 | drill 1.7: P$1 -2.8,5.235; P$2 2.8,5.235
SOT23-5L = smd 0.55 x 1.2: 1 -0.95,-1.3; 2 0,-1.3; 3 0.95,-1.3; 4 0.95,1.3; 5 -0.95,1.3
R2R = drill 0.8 pad 1.676: 1 9.5,0; 2 12.04,0; 3 14.58,0; 4 17.12,0; 5 47.6,0; 6 50.14,0; 7 52.68,0; 8 55.22,0; 9 57.76,0
SOT-23-5 = smd 1.27 x 0.559: 1 -1.295,0.94; 2 -1.295,0; 3 -1.295,-0.94; 4 1.295,-0.94; 5 1.295,0.94
CMODA7 = drill 0.8 square: P$1 59.69,16.51; P$25 1.27,1.27 | drill 0.8: P$2 57.15,16.51; P$3 54.61,16.51; P$4 52.07,16.51; P$5 49.53,16.51; P$6 46.99,16.51; P$7 44.45,16.51; P$8 41.91,16.51; P$9 39.37,16.51; P$10 36.83,16.51; P$11 34.29,16.51; P$12 31.75,16.51; P$13 29.21,16.51; P$14 26.67,16.51; P$15 24.13,16.51; P$16 21.59,16.51; P$17 19.05,16.51; P$18 16.51,16.51; P$19 13.97,16.51; P$20 11.43,16.51; P$21 8.89,16.51; P$22 6.35,16.51; P$23 3.81,16.51; P$24 1.27,16.51; P$26 3.81,1.27; P$27 6.35,1.27; P$28 8.89,1.27; P$29 11.43,1.27; P$30 13.97,1.27; P$31 16.51,1.27; P$32 19.05,1.27; P$33 21.59,1.27; P$34 24.13,1.27; P$35 26.67,1.27; P$36 29.21,1.27; P$37 31.75,1.27; P$38 34.29,1.27; P$39 36.83,1.27; P$40 39.37,1.27; P$41 41.91,1.27; P$42 44.45,1.27; P$43 46.99,1.27; P$44 49.53,1.27; P$45 52.07,1.27; P$46 54.61,1.27; P$47 57.15,1.27; P$48 59.69,1.27
7130MOD = drill 1 pad 2.184 square: 1 23.114,34.798 | drill 1 pad 2.184: 2 23.114,30.988; 3 23.114,27.178; 4 23.114,23.368; 5 23.114,19.558; 6 23.114,15.748; 7 23.114,11.938; 8 23.114,8.128; 9 2.159,8.128; 10 2.159,11.938; 11 2.159,15.748; 12 2.159,19.558; 13 2.159,23.368; 14 2.159,27.178; 15 2.159,30.988; 16 2.159,34.798
NC3MBH = drill 1.6: 1 3.81,0; 2 -3.81,0 | drill 1.2: 3 0,0; G 0,5.08 | hole 1.6: -3.81,13.97; 3.81,8.89
NC4FBH = drill 1.2: 1 -3.81,0.55; 4 3.81,0.55; G -8.25,10.72 | drill 1.6: 2 -3.81,4.365; 3 3.81,4.365 | hole 1.6: -3.81,13.89; 3.81,8.81
MKDSN1,5/2-5,08 = drill 1.3 pad 2.54: 1 -2.561,0.025; 2 2.519,0.025
MKDSN1,5/7-5,08 = drill 1.3 pad 3.81: 1 -15.261,0.025; 2 -10.181,0.025; 3 -5.101,0.025; 4 -0.021,0.025; 5 5.059,0.025; 6 10.139,0.025; 7 15.219,0.025

### Placement (x,y rotation side)
BNC  81,13 180 top
C1  15,11.5 0 top
C2  63.75,31.5 270 top
C3  67.25,21.5 90 bottom
C4  76.5,36.5 90 bottom
C5  85,36.5 90 bottom
C6  100.5,36.5 0 bottom
C7  99.5,28.5 0 bottom
C8  2,81 90 top
C9  13,81 90 top
C10  24.5,81 90 top
C11  2,97 270 top
C12  13.5,97 270 top
C13  25,97 270 top
C20  85,28.5 90 bottom
C21  77.5,28.5 270 bottom
C22  195.78,114.3 90 top
C23  208.49,106.05 180 top
C24  158.96,106.05 180 top
C25  208.49,120.02 180 top
C26  143.72,115.57 90 top
C27  157.69,120.02 180 top
C30  71,35 270 bottom
C31  100,23 180 bottom
C32  92.5,34 270 bottom
C33  79,32.5 0 bottom
C34  12.5,17 90 top
C35  67.5,30.5 270 top
C36  72,17 180 bottom
C40  119,32 270 top
C41  115,32 270 top
C43  104.78,114.3 90 top
C44  117.48,106.05 180 top
C45  18.5,139 270 bottom
C46  23,139 270 bottom
C47  67.95,106.05 180 top
C48  117.48,120.02 180 top
C49  52.72,115.57 90 top
C50  66.69,120.02 180 top
C106  130.5,149 0 bottom
C107  130.5,144.5 0 bottom
C108  140,149 0 top
C109  140,144.5 0 top
C112  130.5,135.5 0 bottom
C113  130.5,140 0 bottom
C114  140,136 0 top
C115  140,140 0 top
C116  149,145 0 top
C117  158,145 0 top
C118  158,149 0 top
C119  149.5,149 0 top
C120  2.25,50 90 bottom
C121  10.5,50.5 90 bottom
C122  29,52 270 top
C123  21,52 270 top
C124  13,52 270 top
C125  13,56.5 90 top
C126  21,56.5 90 top
C127  29,56.5 90 top
C128  2.25,56.62 90 bottom
C129  10.5,56.5 90 bottom
C135  15.5,15.5 90 top
COAX  61,13 180 top
IC1  7,89 0 top
IC2  18.5,89 0 top
IC3  30,89 0 top
IC6  208.49,113.03 180 top
IC7  158.32,113.03 180 top
IC9  25,54 180 top
IC10  17,54 180 top
IC11  8.5,54 180 top
IC12  14.5,54 180 bottom
IC13  6,54 180 bottom
IC15  117.48,113.03 180 top
IC16  67.32,113.03 180 top
JP1  41,7.7 0 top
JP2  20.5,153 90 top
JP3  6.5,148 270 top
JP4  108,58.5 270 top
PCB1  29,102.5 90 top
Q5  162.13,93.98 90 top
Q6  140.54,91.44 0 top
Q7  196.42,92.71 180 top
Q8  216.74,92.71 180 top
Q13  71.13,93.98 90 top
Q14  49.54,91.44 0 top
Q15  105.42,92.71 180 top
Q16  125.74,92.71 180 top
QG1  81.5,35.5 0 top
QG2  100,33.5 90 top
R1  60.03,27.34 0 top
R2  75.16,21.55 270 bottom
R21  206.58,90.17 180 top
R22  218.01,97.79 0 top
R23  151.97,90.17 0 top
R24  140.54,95.25 180 top
R25  206.58,97.79 0 top
R26  151.97,97.79 0 top
R27  179.91,101.6 0 top
R28  151.97,93.98 180 top
R29  179.91,105.41 180 top
R30  206.58,93.98 0 top
R31  200.87,114.3 270 top
R32  216.1,111.76 90 top
R33  197.69,106.05 180 top
R34  148.79,106.05 0 top
R35  149.43,114.94 90 top
R36  166.57,111.76 90 top
R37  171.02,111.76 90 top
R38  219.91,111.76 90 top
R43  20,44 0 top
R44  20,47 0 top
R45  27.5,48 0 top
R46  36.5,23.5 90 top
R47  39,23.5 90 top
R48  41.5,23.5 90 top
R49  88,58 270 top
R50  91,58 270 top
R51  94,58 270 top
R52  94.5,67.5 90 top
R53  97,67.5 90 bottom
R54  99.5,67.5 90 bottom
R69  115.58,90.17 180 top
R70  127.01,97.79 0 top
R71  60.97,90.17 0 top
R72  49.54,95.25 180 top
R73  115.58,97.79 0 top
R74  60.97,97.79 0 top
R75  88.91,101.6 0 top
R76  60.97,93.98 180 top
R77  88.91,105.41 180 top
R78  115.58,93.98 0 top
R79  109.86,114.3 270 top
R80  125.11,111.76 90 top
R81  106.69,106.05 180 top
R82  57.8,106.05 0 top
R83  58.43,114.94 90 top
R84  75.58,111.76 90 top
R85  80.02,111.76 90 top
R86  128.91,111.76 90 top
RCAL  175.3,13 180 top
RCAR  155.7,13 180 top
T1  60.32,21.31 180 top
T2  82.29,21.31 180 top
U1  19,13.5 90 top
U$1  3.4,1.9 0 top
U$2  16.1,8 180 top
U$3  59.98,31.12 180 top
U$4  71.38,21.61 90 bottom
U$9  211.66,78.74 180 top
U$10  81.5,28.5 270 bottom
U$11  211.66,67.31 180 top
U$12  102.5,63 180 top
U$13  177.37,100.33 90 top
U$14  223.09,100.33 90 top
U$15  81,36.5 0 bottom
U$16  100,32 270 bottom
U$21  120.66,78.74 180 top
U$22  120.66,67.31 180 top
U$23  86.37,100.33 90 top
U$24  132.09,100.33 90 top
X1  132.3,17.5 180 top
X2  198.3,17.5 180 top
X3  104,17.5 180 top
X4  126,32 90 top
X5  145,155.5 180 top
X6  5.5,135 90 top

### Tracks (layer width: path | path; a pad name or v marks a point on that pad's centre or on a via)
22.5792  (1 unrouted)
24.756  (1 unrouted)
+15V  (18 unrouted)
-15V  (22 unrouted)
A  (1 unrouted)
B  (1 unrouted)
BCKI  (1 unrouted)
BNCIN  (1 unrouted)
COAXIN  (1 unrouted)
D2  (1 unrouted)
D3  (1 unrouted)
D4  (1 unrouted)
D5  (1 unrouted)
DACA  (4 unrouted)
DACD  (4 unrouted)
DATAI  (1 unrouted)
DSD  (1 unrouted)
F0  (1 unrouted)
F1  (1 unrouted)
F2  (1 unrouted)
F3  (1 unrouted)
FV  (21 unrouted)
GND  (97 unrouted)
I3V3  (22 unrouted)
K  (1 unrouted)
L+OUT  (2 unrouted)
L-OUT  (1 unrouted)
LRCKI  (1 unrouted)
MCUGND  (18 unrouted)
MCUV  (3 unrouted)
N$1  (1 unrouted)
N$2  (1 unrouted)
N$3  (1 unrouted)
N$4  (1 unrouted)
N$5  (2 unrouted)
N$6  (2 unrouted)
N$7  (2 unrouted)
N$8  (2 unrouted)
N$9  (via drill 3.2 pad 1.02)
  other vias: 79.9,98.1
N$18  (via drill 3.2 pad 1.02)
  other vias: 215.9,16.1
N$19  (via drill 3.2 pad 1.02)
  other vias: 215.9,156
N$20  (1 unrouted)
N$21  (via drill 3.2 pad 1.02)
  other vias: 215.9,106.6
N$22  (via drill 3.2 pad 1.02)
  other vias: 3.9,16.1
N$23  (via drill 3.2 pad 1.02)
  other vias: 3.9,156
N$24  (via drill 3.2 pad 1.02)
  other vias: 3.9,106.6
N$25  (3 unrouted)
N$27  (3 unrouted)
N$32  (1 unrouted)
N$33  (1 unrouted)
N$35  (1 unrouted)
N$36  (1 unrouted)
N$39  (1 unrouted)
N$40  (1 unrouted)
N$42  (1 unrouted)
N$43  (1 unrouted)
N$44  (1 unrouted)
N$45  (1 unrouted)
N$46  (1 unrouted)
N$51  (1 unrouted)
N$52  (1 unrouted)
N$53  (1 unrouted)
N$54  (1 unrouted)
N$55  (1 unrouted)
N$56  (1 unrouted)
N$57  (1 unrouted)
N$65  (1 unrouted)
N$66  (1 unrouted)
N$67  (1 unrouted)
N$68  (3 unrouted)
N$69  (2 unrouted)
N$70  (2 unrouted)
N$71  (2 unrouted)
N$72  (2 unrouted)
N$73  (1 unrouted)
N$74  (3 unrouted)
N$75  (1 unrouted)
N$76  (1 unrouted)
N$77  (3 unrouted)
N$78  (2 unrouted)
N$79  (3 unrouted)
N$80  (2 unrouted)
N$81  (2 unrouted)
N$82  (2 unrouted)
N$83  (2 unrouted)
N$84  (2 unrouted)
N$85  (2 unrouted)
N$86  (1 unrouted)
N$87  (2 unrouted)
N$88  (2 unrouted)
N$89  (via drill 3.2 pad 1.02)
  other vias: 109.9,156
N$90  (1 unrouted)
N$91  (8 unrouted)
N$92  (1 unrouted)
N$93  (1 unrouted)
N$94  (1 unrouted)
N$95  (1 unrouted)
N$97  (1 unrouted)
N$98  (11 unrouted)
N$99  (1 unrouted)
N$100  (1 unrouted)
N$101  (1 unrouted)
N$102  (1 unrouted)
N$103  (1 unrouted)
N$104  (2 unrouted)
N$105  (2 unrouted)
N$106  (2 unrouted)
N$107  (1 unrouted)
N$108  (2 unrouted)
N$129  (1 unrouted)
N$132  (1 unrouted)
N$133  (1 unrouted)
N$134  (1 unrouted)
N$135  (1 unrouted)
N$136  (1 unrouted)
N$137  (1 unrouted)
N$138  (1 unrouted)
N$139  (1 unrouted)
N$140  (1 unrouted)
N$141  (1 unrouted)
N$148  (1 unrouted)
N$149  (1 unrouted)
N$150  (1 unrouted)
N$151  (3 unrouted)
N$152  (2 unrouted)
N$153  (2 unrouted)
N$154  (2 unrouted)
N$155  (2 unrouted)
N$156  (1 unrouted)
N$157  (3 unrouted)
N$158  (1 unrouted)
N$159  (1 unrouted)
N$160  (3 unrouted)
N$161  (2 unrouted)
N$162  (3 unrouted)
N$163  (2 unrouted)
N$164  (2 unrouted)
N$165  (2 unrouted)
N$166  (2 unrouted)
N$167  (2 unrouted)
N$168  (2 unrouted)
N$169  (2 unrouted)
N$170  (2 unrouted)
N$171  (2 unrouted)
N$172  (2 unrouted)
N$173  (2 unrouted)
N$174  (1 unrouted)
N$175  (2 unrouted)
R+OUT  (2 unrouted)
R-OUT  (1 unrouted)
RBCLK  (1 unrouted)
RDATA  (1 unrouted)
RDSDON  (1 unrouted)
RLRCK  (1 unrouted)
SCK  (1 unrouted)
SISO  (1 unrouted)
STB  (1 unrouted)
TOSLINK  (1 unrouted)
UCLK  (1 unrouted)
UDATA  (1 unrouted)
UDSDON  (1 unrouted)
UGND  (13 unrouted)
ULRCK  (1 unrouted)

### Text on the board
tPlace: VDAC-V2 | LED / +5V / GND | Vwvwbg | D5V / GND / A5V / GND / +15V / GND / -15V | M5V / GND | R.ch | L.ch | F5V / GND
tNames: L- | L+